# EAGLE design badge-seeed (EAGLE 7.7.0)
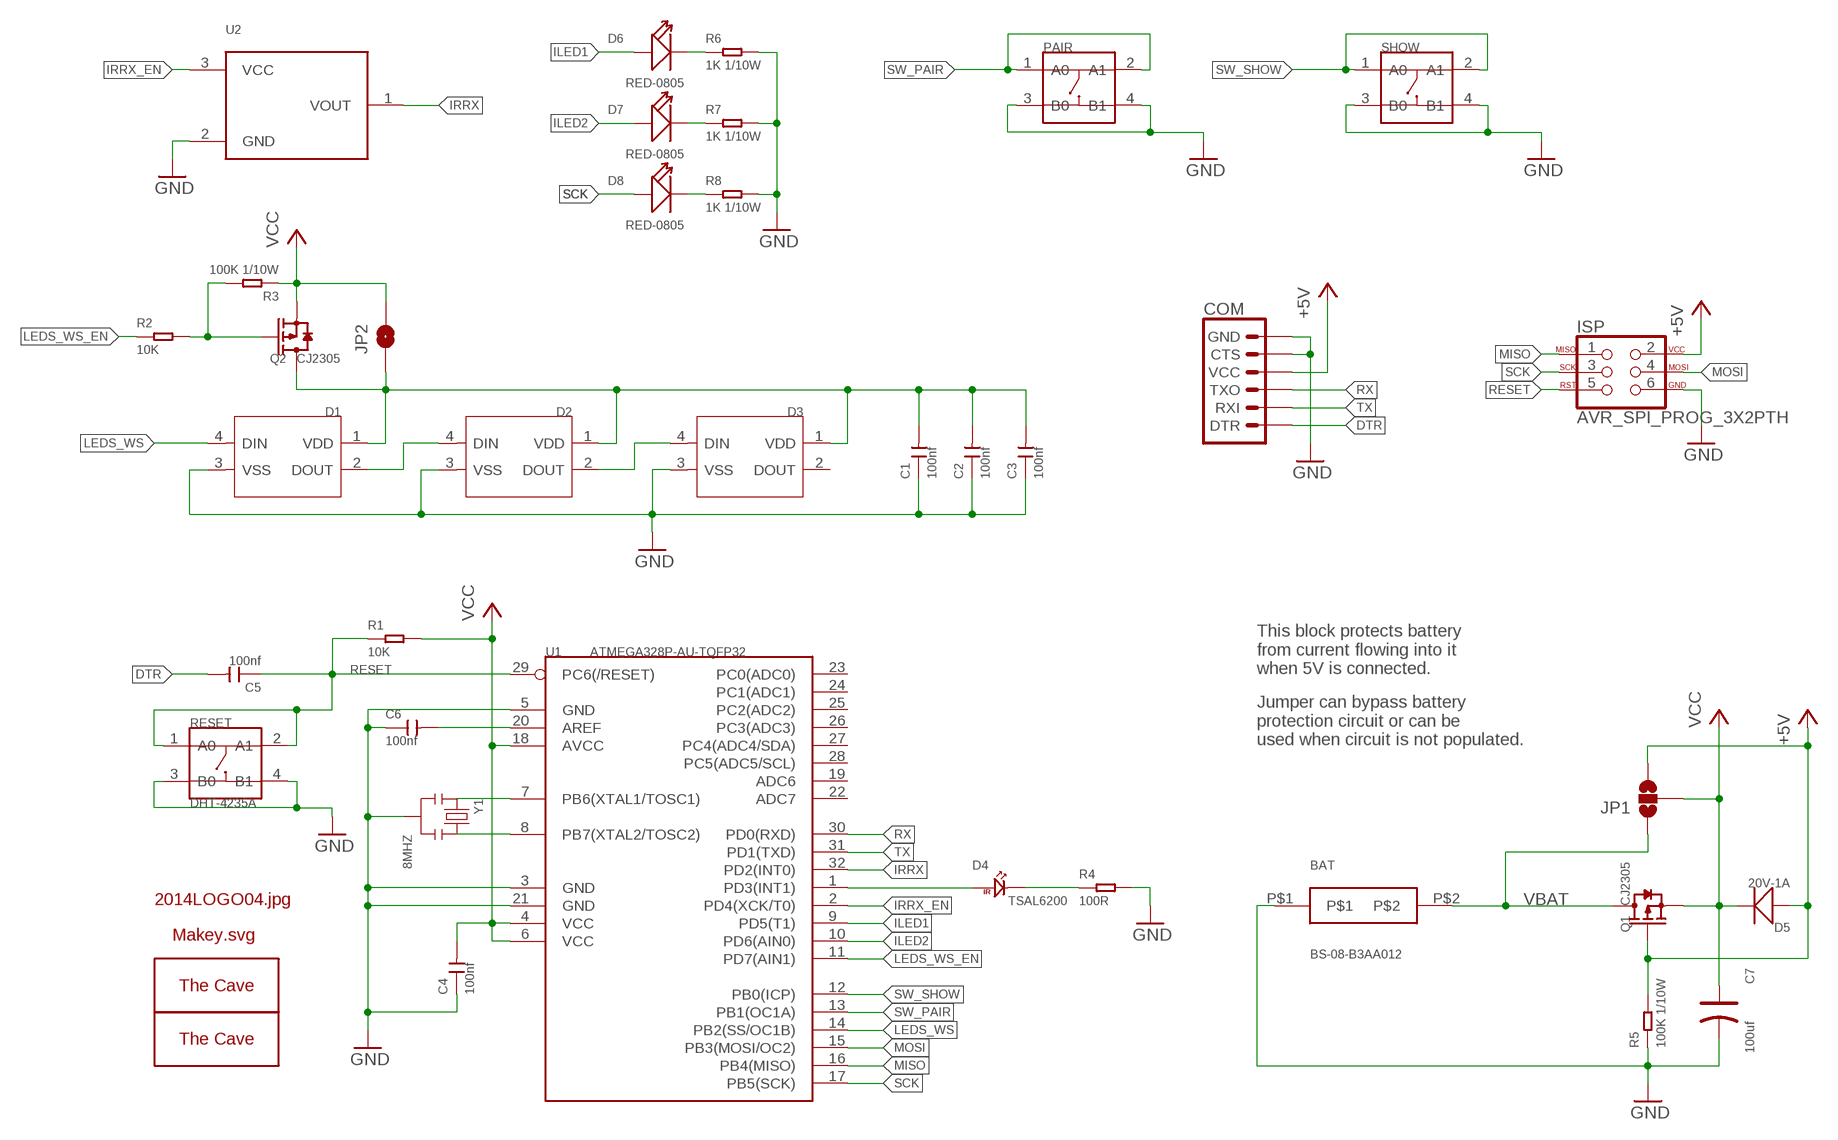
[diagram p0: schematic, sheet 1]

## Parts
BAT  BS-08-B3AA012  [B3-08-B3AA012]
C1  100nf  CERAMIC-100NF-50V-10%-X7R(0603)  [C0603]
C2  100nf  CERAMIC-100NF-50V-10%-X7R(0603)  [C0603]
C3  100nf  CERAMIC-100NF-50V-10%-X7R(0603)  [C0603]
C4  100nf  CERAMIC-100NF-50V-10%-X7R(0603)  [C0603]
C5  100nf  CERAMIC-100NF-50V-10%-X7R(0603)  [C0603]
C6  100nf  CERAMIC-100NF-50V-10%-X7R(0603)  [C0603]
C7  100uf  TANTALUM-SMD-100UF-10V(AVX-B)  [AVX-B]
COM  6_PIN_SERIAL_TARGETSILK  [6_PIN_SERIAL_TARGET_SIDE_W_SILK]
D1  SMD-RGB-LED-4P'WS2812B'  [LED4-SMD-5050]
D2  SMD-RGB-LED-4P'WS2812B'  [LED4-SMD-5050]
D3  SMD-RGB-LED-4P'WS2812B'  [LED4-SMD-5050]
D4  TSAL6200  [TSAL6200]
D5  20V-1A  SMD-DIODE-SCHOTTKY-20V-1A(SOD-123)  [SOD-123]
D6  RED-0805  SMD-LED-CLEAR-RED(0805)  [LED-0805]
D7  RED-0805  SMD-LED-CLEAR-RED(0805)  [LED-0805]
D8  RED-0805  SMD-LED-CLEAR-RED(0805)  [LED-0805]
ISP  AVR_SPI_PROG_3X2PTH  [2X3]
JP1  JUMPER-SMT_3_NO_SILK  [SMT-JUMPER_3_NO_SILK]
JP2  JUMPER-SMT_2_NO_SILK  [SMT-JUMPER_2_NO_SILK]
PAIR  SMD-BUTTON(4P-5.2X5.2X1.5MM-SKQGADE010)-SKQGADE010  [SW4-SMD-5.2X5.2X1.5MM]
Q1  CJ2305  SMD-MOSFET-P-CH-8V-4.1A-CJ2305(SOT-23)  [SOT-23]
Q2  CJ2305  SMD-MOSFET-P-CH-8V-4.1A-CJ2305(SOT-23)  [SOT-23]
R1  10K  SMD-RES-10K-1%-1/10W(0603)  [R0603]
R2  10K  SMD-RES-10K-1%-1/10W(0603)  [R0603]
R3  100K 1/10W  SMD-RES-100K-5%-1/10W(0603)  [R0603]
R4  100R  SMD-RES-100R-5%-1/8W(0805)  [R0805]
R5  100K 1/10W  SMD-RES-100K-5%-1/10W(0603)  [R0603]
R6  1K 1/10W  SMD-RES-1K-5%-1/10W(0603)  [R0603]
R7  1K 1/10W  SMD-RES-1K-5%-1/10W(0603)  [R0603]
R8  1K 1/10W  SMD-RES-1K-5%-1/10W(0603)  [R0603]
RESET  DHT-4235A  SMD-BUTTON-TOP-DHT-4235A(4P-4.2X3.2MM)  [SW4-SMD-4.2X3.2X2.5MM]
SHOW  SMD-BUTTON(4P-5.2X5.2X1.5MM-SKQGADE010)-SKQGADE010  [SW4-SMD-5.2X5.2X1.5MM]
U1  ATMEGA328P-AU-TQFP32  MCU-ATMEGA328P-AU(TQFP32)  [TQFP32-0.8-7X7MM]
U2  TSOP382  [TSOP382]
U$1  2014LOGO04#JPG  [2014LOGO04#JPG]
U$2  MAKEY#SVG  [MAKEY#SVG]
U$3  THECAVE_LOGO_TOP_SMALL  [LOGO_TOP_SMALL]
U$4  THECAVE_LOGO_COPPER_TEXT  [LOGO_COPPER_TEXT]
Y1  8MHZ  SMD-CRYSTAL-8MHZ--0.3%-150R(3P-3.6X1.3MM)  [X3-SMD-3.6X1.3X0.8MM]

## Nets
+5V: COM.P$4(VCC) D5.+ ISP.2 JP1.3 Q1.1(G) R5.2
DTR: C5.2 COM.P$1(DTR)
GND: BAT.P$1 C1.1 C2.1 C3.1 C4.1 C6.1 C7.- COM.P$5(CTS) COM.P$6(GND) D1.3(VSS) D2.3(VSS) D3.3(VSS) ISP.6 PAIR.3(B0) PAIR.4(B1) R4.2 R5.1 R6.2 R7.2 R8.2 RESET.3(B0) RESET.4(B1) SHOW.3(B0) SHOW.4(B1) U1.3(GND) U1.5(GND) U1.21(GND) U2.2(GND) Y1.2
ILED1: D6.+ U1.9(PD5(T1))
ILED2: D7.+ U1.10(PD6(AIN0))
IRRX: U1.32(PD2(INT0)) U2.1(VOUT)
IRRX_EN: U1.2(PD4(XCK/T0)) U2.3(VCC)
LEDS_WS: D1.4(DIN) U1.14(PB2(SS/OC1B))
LEDS_WS_EN: R2.1 U1.11(PD7(AIN1))
MISO: ISP.1 U1.16(PB4(MISO))
MOSI: ISP.4 U1.15(PB3(MOSI/OC2))
N$1: D1.2(DOUT) D2.4(DIN)
N$2: D2.2(DOUT) D3.4(DIN)
N$3: D7.- R7.1
N$4: U1.7(PB6(XTAL1/TOSC1)) Y1.1
N$5: U1.8(PB7(XTAL2/TOSC2)) Y1.3
N$6: D4.N R4.1
N$7: C6.2 U1.20(AREF)
N$8: D6.- R6.1
N$9: D8.- R8.1
N$10: C1.2 C2.2 C3.2 D1.1(VDD) D2.1(VDD) D3.1(VDD) JP2.1 Q2.3(D)
N$11: D4.P U1.1(PD3(INT1))
N$12: Q2.1(G) R2.2 R3.2
RESET: C5.1 ISP.5 R1.1 RESET.1(A0) RESET.2(A1) U1.29(PC6(/RESET))
RX: COM.P$2(TXO) U1.30(PD0(RXD))
SCK: D8.+ ISP.3 U1.17(PB5(SCK))
SW_PAIR: PAIR.1(A0) PAIR.2(A1) U1.13(PB1(OC1A))
SW_SHOW: SHOW.1(A0) SHOW.2(A1) U1.12(PB0(ICP))
TX: COM.P$3(RXI) U1.31(PD1(TXD))
VBAT: BAT.P$2 JP1.1 Q1.3(D)
VCC: C4.2 C7.+ D5.- JP1.2 JP2.2 Q1.2(S) Q2.2(S) R1.2 R3.1 U1.4(VCC) U1.6(VCC) U1.18(AVCC)
Unconnected: D3.2(DOUT) U1.19(ADC6) U1.22(ADC7) U1.23(PC0(ADC0)) U1.24(PC1(ADC1)) U1.25(PC2(ADC2)) U1.26(PC3(ADC3)) U1.27(PC4(ADC4/SDA)) U1.28(PC5(ADC5/SCL))

## Notes on the sheet
- This block protects battery
  from current flowing into it
  when 5V is connected.
- Jumper can bypass battery
  protection circuit or can be
  used when circuit is not populated.

## Library data of the parts
BAT = Seeed-OPL-2017-01-connector-edward:BS-08-B3AA012: 320170000
C1-C6 = Seeed-Capacitor:CERAMIC-100NF-50V-10%-X7R(0603): 302010138; MPN: CC0603KRX7R9BB104
C7 = Seeed-Capacitor:TANTALUM-SMD-100UF-10V(AVX-B): 302020015; MPN: TAJB107M010#NJ
COM = SparkFun-Connectors:6_PIN_SERIAL_TARGET: 6-pin header connection for use with the "FTDI BASIC" pinout - TARGET SIDE. Also known as "Arduino Serial Program Header". It is used to mate with our FTDI Basic serial programmers using the Arduino IDE. Note, this device has "TARGET" in the name. It is intended to be used on a design that contains a target micro-controller that you wish to program. The "sister" device, named "CABLE" is inteneded to be used on a design that usually lives on the end of your USB cable and prvides the converter chip (FTDI232 or FTDI231x) to commnicate serial RX/TX. You can populate with some of these: Break Away Headers - Straight <https://www.sparkfun.com/products/116> (PRT-00116) For reference (or to suit your programming needs) check out these designs: SparkFun FTDI Basic Breakout - 5V <https://www.sparkfun.com/products/9716> (DEV-09716) SparkFun FTDI Basic Breakout - 3.3V <https://www.sparkfun.com/products/9873> (DEV-09873) SparkFun FTDI SmartBasic <https://www.sparkfun.com/products/12935> (DEV-12935) SparkFun Beefy 3 - FTDI Basic Breakout <https://www.sparkfun.com/products/13746> (DEV-13746)
D1-D3 = Seeed-Diode:SMD-RGB-LED-4P: 304990003
D4 = Seeed-OPL-2017-01-Sensor-camilo:TSAL6200: 314020023
D5 = Seeed-OPL-2017-01-Diode-james:SMD-DIODE-SCHOTTKY-20V-1A(SOD-123): 304020034; MPN: B5819W
D6-D8 = Seeed-LED:SMD-LED-CLEAR-RED(0805): 304090046; MPN: 17-215SURC/S530-A2/TR8
ISP = SparkFun-Connectors:AVR_SPI_PROG_3X2: AVR ISP 6 Pin This is the reduced ISP connector for AVR programming. Common on Arduino. This footprint will take up less PCB space and can be used with a 10-pin to 6-pin adapter such as SKU: BOB-08508 **Special note about "TEST_POINT" package. The stop mask is on the top side, so if you want your programming test points to be on the bottom of your board, make sure to place this package on the bottom side of the board. This also ensure that the orientation to program from the bottom side will be correct. SparkFun Products: SparkFun ISP Pogo Adapter <https://www.sparkfun.com/products/11591> - NS Tiny AVR Programmer <https://www.sparkfun.com/products/11801> -PTH
JP1 = SparkFun-Jumpers:JUMPER-SMT_3_NO: Normally open jumper This jumper has three pads in close proximity to each other. Apply solder to close the connection(s).
JP2 = SparkFun-Jumpers:JUMPER-SMT_2_NO: Normally open jumper This jumper has two pads in close proximity to each other. Apply solder to close the connection. Round pads are easier to solder for beginners, but are a lot larger. SparkFun Product that uses the round pads: SparkFun EL Sequencer <https://www.sparkfun.com/products/12781>
PAIR SHOW = Seeed-Switch:SMD-BUTTON(4P-5.2X5.2X1.5MM-SKQGADE010): 311020017; MPN: SKQGADE010; VALUE: SKQGADE010
Q1 Q2 = Seeed-Transistor:SMD-MOSFET-P-CH-8V-4.1A-CJ2305(SOT-23): 305030014; MPN: CJ2305
R1 R2 = Seeed-Resistor:SMD-RES-10K-1%-1/10W(0603): 301010299; MPN: RC0603FR-0710KL
R3 R5 = Seeed-Resistor:SMD-RES-100K-5%-1/10W(0603): 301010089; MPN: RC0603JR-07100KL
R4 = Seeed-Resistor:SMD-RES-100R-5%-1/8W(0805): 301010319; MPN: RC0805JR-07100RL
R6-R8 = Seeed-Resistor:SMD-RES-1K-5%-1/10W(0603): 301010291; MPN: RC0603JR-071KL
RESET = Seeed-Switch:SMD-BUTTON-TOP-DHT-4235A(4P-4.2X3.2MM): 311020045; MPN: DHT-4235A
U1 = Seeed-IC:MCU-ATMEGA328P-AU(TQFP32): 310010049; MPN: ATMEGA328P-AU
U2 = Seeed-OPL-2017-01-Sensor-camilo:TSOP382: 314020013
U$1 = 2014LOGO04#jpg:2014LOGO04#JPG
U$2 = Makey#svg:MAKEY#SVG
U$3 U$4 = thecave:THECAVE_LOGO: The Cave DIY workshop logos thecave.cz
Y1 = Seeed-Crystal Oscillator:SMD-CRYSTAL-8MHZ--0.3%-150R(3P-3.6X1.3MM): 306010053

## Board
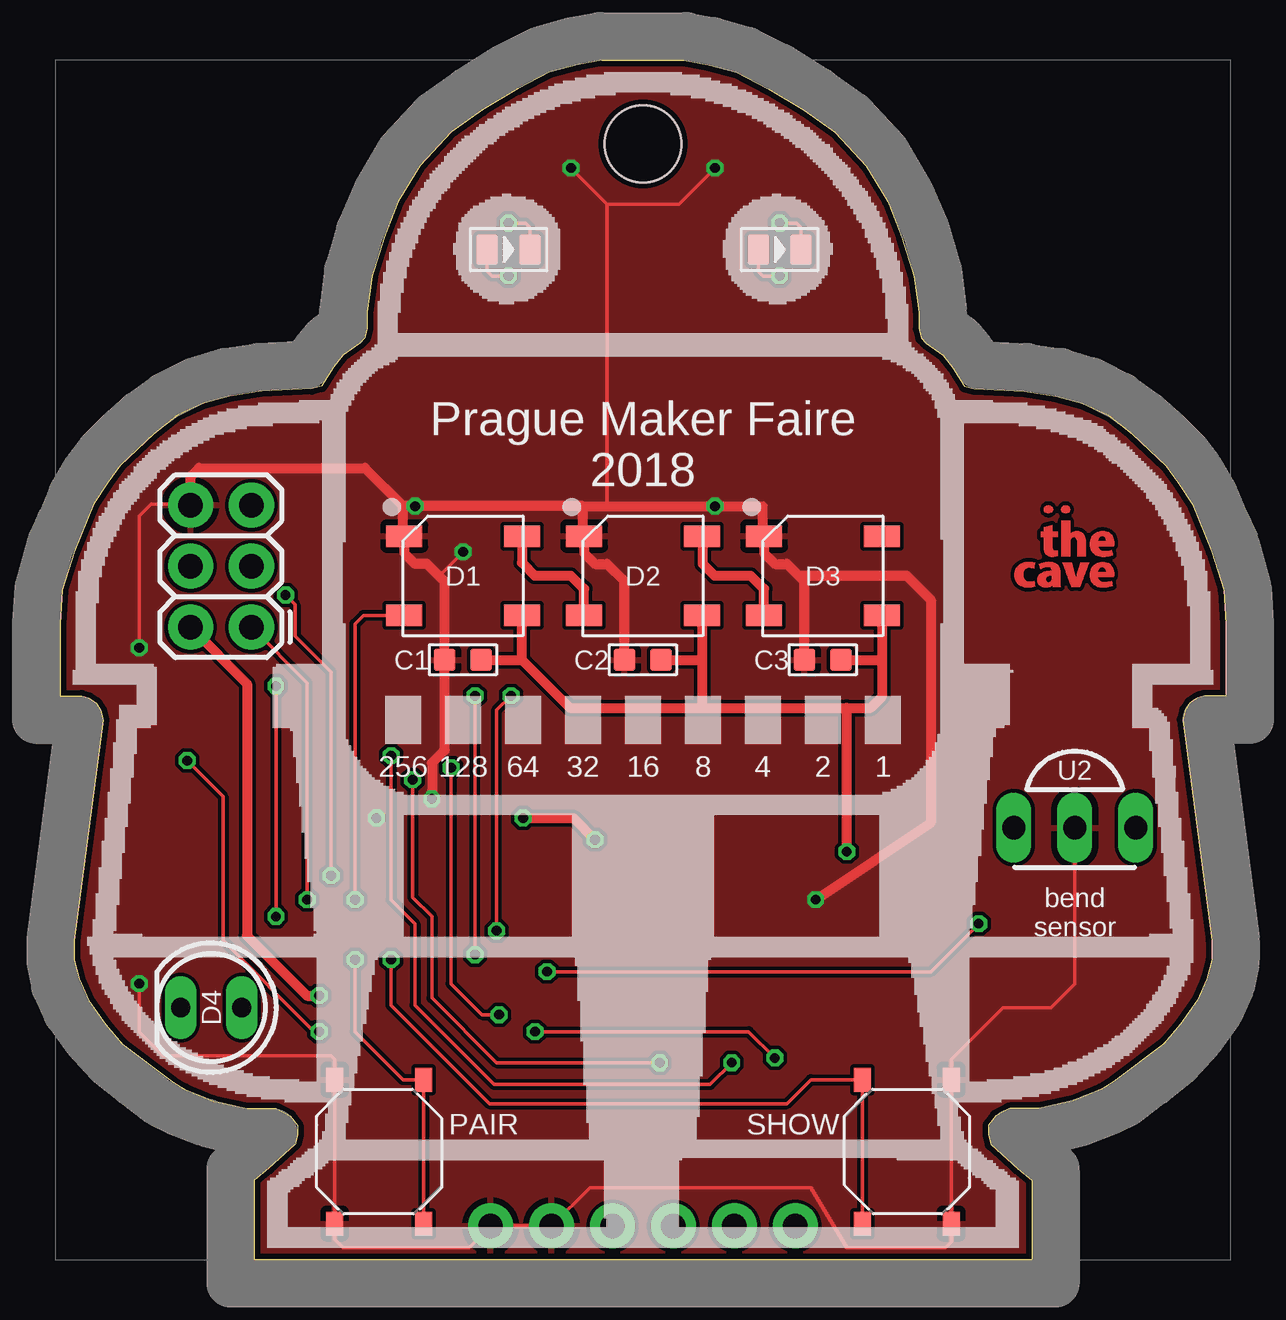
[diagram p1: board, top side]
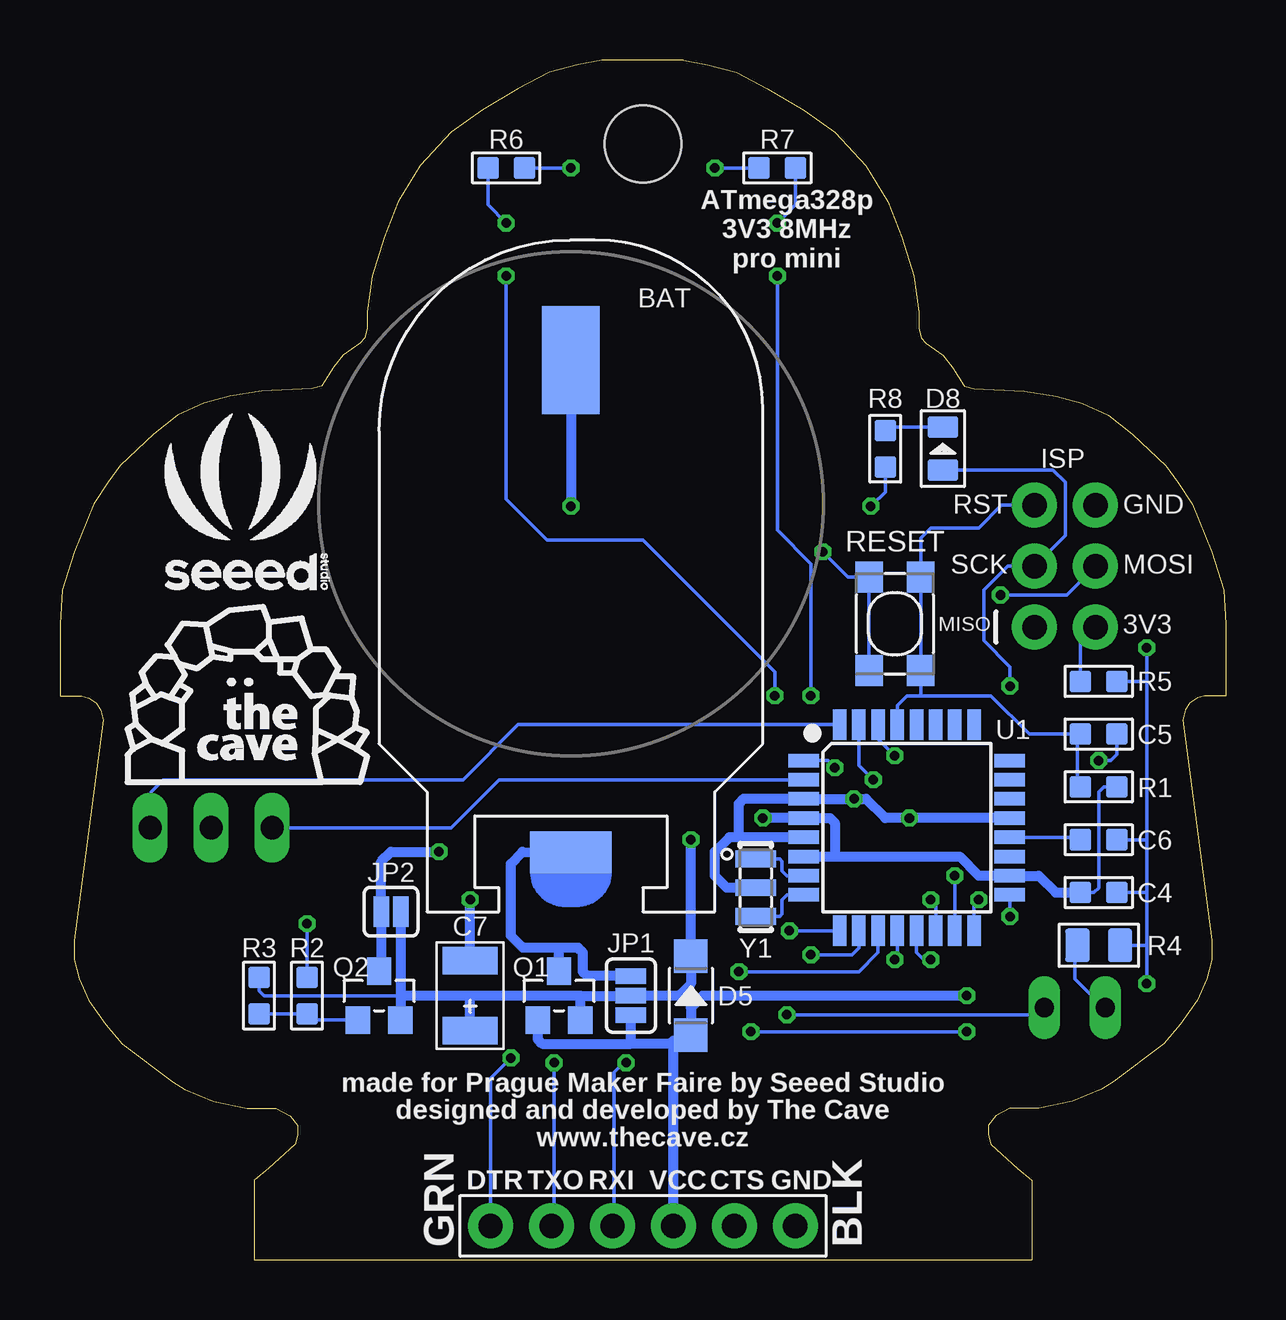
[diagram p2: board, bottom side, seen from below]

Size 48.6 x 50 mm. Coordinates in mm from the lower left corner, seen from the top.
Outline: 22.6,50 21.6,49.8 20.4,49.5 19.1,48.8 17.6,47.9 16.3,47 15,45.6 14.1,44.1 13.5,42.6 13,41 12.8,39.5 12.8,38.8 12.7,38.4 12.5,38.2 11.8,37.7 11.4,37.2 10.9,36.4 10.5,36.3 8.4,36.2 7.1,36 6,35.7 4.9,35.2 3.9,34.4 2.5,33.1 2,32.4 1.4,31.5 0.6,29.5 0.1,27.9 0,26.5 0,23.5 0.9,23.5 1.2,23.4 1.5,23.2 1.7,22.9 1.8,22.5 0.6,13.3 0.6,12.5 0.8,11.7 1.2,10.8 1.9,9.8 2.6,9 4.7,7.4 5.2,7.1 6.4,6.6 7.8,6.3 9,6.3 9.6,6 9.9,5.6 9.9,5.2 9.8,4.8 8.7,3.8 8.1,3.3 8.1,0 40.5,0 40.5,3.3 39.9,3.8 38.8,4.8 38.7,5.2 38.7,5.6 39,6 39.6,6.3 40.8,6.3 42.2,6.6 43.4,7.1 43.9,7.4 46,9 46.7,9.8 47.4,10.8 47.8,11.7 48,12.5 48,13.3 46.8,22.5 46.9,22.9 47.1,23.2 47.4,23.4 47.7,23.5 48.6,23.5 48.6,26.5 48.5,27.9 48,29.5 47.2,31.5 46.6,32.4 46.1,33.1 44.7,34.4 43.7,35.2 42.6,35.7 41.5,36 40.2,36.2 38.1,36.3 37.7,36.4 37.2,37.2 36.8,37.7 36.1,38.2 35.9,38.4 35.8,38.8 35.8,39.5 35.6,41 35.1,42.6 34.5,44.1 33.6,45.6 32.3,47 31,47.9 29.5,48.8 28.2,49.5 27,49.8 26,50 22.6,50
Copper layers (1*16): Top 0.035mm / dielectric 1.5mm / Bottom 0.035mm
Design rules "SeeedStudio_2layer_DRU_no_angle_20140221": minimum track width 6mil, minimum drill 12mil, track to track 6mil, track to pad 6mil, pad to pad 6mil, via to via 6mil, smd to smd 0mil, copper to edge 10mil, drill to drill 10mil, minimum pad ring 10mil, minimum via ring 6mil, stop-mask expansion 2mil, vias tented up to drill 100mil, thermal gap 10mil
Holes 3.2 mm at 24.3,46.5

### Footprints (pad centres in the part's own frame; a part is rotated, then mirrored left to right if it is on the bottom)
B3-08-B3AA012 = smd 4.5 x 2.4: P$1 0,0 | smd 1.75 x 3.4: P$2 20.525,0
C0603 = smd 0.889 x 0.889: 1 0,0.762; 2 0,-0.762
AVX-B = smd 1.143 x 2.286: + -1.46,0; - 1.46,0
6_PIN_SERIAL_TARGET_SIDE_W_SILK = drill 1.016 pad 1.88: P$1 -6.35,0; P$2 -3.81,0; P$3 -1.27,0; P$4 1.27,0; P$5 3.81,0; P$6 6.35,0
LED4-SMD-5050 = smd 1.5 x 0.9: 1 -2.45,1.65; 2 -2.45,-1.65; 3 2.45,-1.65; 4 2.45,1.65
TSAL6200 = drill 0.8 long: N 1.27,0; P -1.27,0
SOD-123 = smd 1.397 x 1.397: + -1.651,0; - 1.651,0
LED-0805 = smd 0.889 x 1.27: + -0.889,0; - 0.889,0
2X3 = drill 1.016 pad 1.88: 1 0,0; 2 0,2.54; 3 2.54,0; 4 2.54,2.54; 5 5.08,0; 6 5.08,2.54
SMT-JUMPER_3_NO_SILK = smd 0.635 x 1.27: 1 -0.813,0; 2 0,0; 3 0.813,0
SMT-JUMPER_2_NO_SILK = smd 0.635 x 1.27: 1 -0.406,0; 2 0.406,0
SW4-SMD-5.2X5.2X1.5MM = smd 1 x 0.7: 1 -3,1.85; 2 3,1.85; 3 -3,-1.85; 4 3,-1.85
SOT-23 = smd 1.016 x 1.143: 1 -0.889,-1.016; 2 0.889,-1.016; 3 0,1.016
R0603 = smd 0.889 x 0.889: 1 0,0.762; 2 0,-0.762
R0805 = smd 1.397 x 1.016: 1 0,0.889; 2 0,-0.889
SW4-SMD-4.2X3.2X2.5MM = smd 1.3 x 1.15: 1 -1.95,1.075; 2 1.95,1.075; 3 -1.95,-1.075; 4 1.95,-1.075
TQFP32-0.8-7X7MM = smd 1.27 x 0.559: 1 -4.293,2.8; 2 -4.293,2; 3 -4.293,1.2; 4 -4.293,0.4; 5 -4.293,-0.4; 6 -4.293,-1.2; 7 -4.293,-2; 8 -4.293,-2.8; 17 4.293,-2.8; 18 4.293,-2; 19 4.293,-1.2; 20 4.293,-0.4; 21 4.293,0.4; 22 4.293,1.2; 23 4.293,2; 24 4.293,2.8 | smd 0.559 x 1.27: 9 -2.8,-4.293; 10 -2,-4.293; 11 -1.2,-4.293; 12 -0.4,-4.293; 13 0.4,-4.293; 14 1.2,-4.293; 15 2,-4.293; 16 2.8,-4.293; 25 2.8,4.293; 26 2,4.293; 27 1.2,4.293; 28 0.4,4.293; 29 -0.4,4.293; 30 -1.2,4.293; 31 -2,4.293; 32 -2.8,4.293
TSOP382 = drill 0.96 long: 1 2.54,0; 2 0,0; 3 -2.54,0
X3-SMD-3.6X1.3X0.8MM = smd 0.7 x 1.7: 1 -1.2,0; 2 0,0; 3 1.2,0

### Placement (x,y rotation side)
BAT  27.3,37.5 270 bottom
C1  16.8,25 90 top
C2  24.3,25 90 top
C3  31.8,25 90 top
C4  5.3,15.3 270 bottom
C5  5.3,21.9 90 bottom
C6  5.3,17.5 270 bottom
C7  31.5,11 90 bottom
COM  24.3,1.4 0 bottom
D1  16.8,28.5 180 top
D2  24.3,28.5 180 top
D3  31.8,28.5 180 top
D4  6.3,10.5 180 top
D5  22.3,11 90 bottom
D6  30,42.1 0 top
D7  18.7,42.1 0 top
D8  11.8,33.8 90 bottom
ISP  7.98,26.36 90 top
JP1  24.8,11 270 bottom
JP2  34.8,14.5 0 bottom
PAIR  13.3,4.5 270 top
Q1  27.8,11 0 bottom
Q2  35.3,11 0 bottom
R1  5.3,19.7 90 bottom
R2  38.3,11 0 bottom
R3  40.3,11 0 bottom
R4  5.3,13.1 90 bottom
R5  5.3,24.1 270 bottom
R6  30,45.5 90 bottom
R7  18.7,45.5 270 bottom
R8  14.2,33.8 0 bottom
RESET  13.8,26.5 270 bottom
SHOW  35.3,4.5 90 top
U1  13.3,18 0 bottom
U2  42.3,18 0 top
U$1  40.8,31.5 0 bottom
U$2  24.3,25 0 top
U$3  45.8,19.9 0 bottom
U$4  39.8,28 0 top
Y1  19.6,15.5 270 bottom

### Tracks (layer width: path | path; a pad name or v marks a point on that pad's centre or on a via)
+5V  (via drill 0.4)
  Top 0.406: ISP.2 7.8,24 7.8,13.5 10.3,11 v10.8,11
  Bottom 0.152: R5.2 6.06,25.74 ISP.2
  Bottom 0.406: Q1.1 28.69,9.19 28.5,9 24.8,9 | 24.8,9 JP1.3 | D5.+ 23.15,9 24.8,9 | COM.P$4 23.03,9.12 D5.+ | v10.8,11 21.8,11 22.3,10.5 D5.+ | 22.45,9 D5.+ | 22.65,9.5 D5.+
DTR  (via drill 0.4)
  Top 0.152: v29.8,8.4 28.7,9.5 v19.8,9.5 | v10.8,9.5 10.6,9.5 6.8,13.3 6.8,19.3 v5.3,20.8
  Bottom 0.152: v10.8,9.5 v19.8,9.5 | v5.3,20.8 4.8,20.8 4.54,21.06 C5.2 | COM.P$1 30.65,7.55 v29.8,8.4
GND  (via drill 0.4)
  Top 0.152: v27.3,45.5 25.8,44 22.8,44 | v21.3,45.5 22.8,44 | v3.3,25.5 3.3,31 3.8,31.5 5.38,31.5 ISP.6 | v3.3,11.5 3.3,9.5 4.3,8.5 11.3,8.5 11.45,8.35 PAIR.3 PAIR.4 11.45,0.85 11.8,0.5 17.05,0.5 COM.P$6 COM.P$5 22.09,3 31.3,3 32.8,0.5 36.9,0.5 37.15,0.75 SHOW.3 SHOW.4 37.15,8.35 39.3,10.5 41.3,10.5 42.3,11.5 U2.2 | 22.8,44 22.8,31.4 | v16.8,29.5 15.8,28.5
  Top 0.406: D2.3 21.8,30.2 | D2.3 21.85,29.45 22.3,29 22.8,29 23.53,28.27 23.53,25.01 C2.1 | 30.8,28.5 30.3,29 29.8,29 29.35,29.45 D3.3 29.3,30.15 29.3,31.4 v27.3,31.4 22.8,31.4 21.8,31.4 | 14.3,31.4 14.3,30.2 D1.3 14.35,29.45 14.8,29 15.3,29 15.8,28.5 16.03,28.27 16.03,25.01 | D2.3 21.8,30.15 21.8,31.4 | 21.8,31.4 v14.8,31.4 14.3,31.4 | 14.3,31.4 12.7,33 5.8,33 5.44,32.64 ISP.6 | v15.5,19.2 15.5,20.7 16.04,21.24 C1.1 | 30.8,28.5 35.3,28.5 36.3,27.5 36.3,18.2 v31.5,15 | v13.19,18.4 v13.2,18.4 | C3.1 31.04,28.26 30.8,28.5
  Bottom 0.152: R4.2 3.3,13.1 | v3.3,25.5 3.3,24.1 | 3.3,24.1 3.3,17.5 | 3.3,17.5 3.3,15.3 | 3.3,15.3 3.3,13.1 | 3.3,13.1 v3.3,11.5 | RESET.4 RESET.3 15.75,28.45 v16.8,29.5 | R5.1 3.3,24.1 | 14.5,31.7 v14.8,31.4 14.2,32 R8.2 | C6.1 3.3,17.5 | C4.1 3.3,15.3 | R6.2 v27.3,45.5 | R7.2 v21.3,45.5
  Bottom 0.406: U1.21 v13.19,18.4 14.2,18.4 15,19.2 v15.5,19.2 U1.3 20.1,19.2 20.3,19 20.3,17.6 | U1.5 20.3,17.6 | 20.3,17.6 20.7,17.6 21.3,17 21.3,16 20.8,15.5 Y1.2 | BAT.P$1 v27.3,31.4 | C7.- v31.5,15
  pour Top: -1.7,-1.5 -1.7,50 50.3,50.5 50.3,-1
ILED1  (via drill 0.4)
  Top 0.152: v18.2,13.7 18.2,22.9 v18.8,23.5 | v30,41 29.3,41 29.1,41.2 29.11,41.21 D6.+
  Bottom 0.152: U1.9 16.99,13.71 17.7,13.7 v18.2,13.7 | v18.8,23.5 18.8,24.5 24.3,30 28.3,30 30,31.7 v30,41
ILED2  (via drill 0.4)
  Top 0.152: v17.3,12.7 17.3,13.2 v17.3,23.5 | v18.7,41 18,41 17.8,41.2 17.81,41.21 D7.+
  Bottom 0.152: U1.10 15.3,13 15.6,12.7 v17.3,12.7 | v17.3,23.5 17.3,29 18.7,30.4 v18.7,41
IRRX
  Bottom 0.152: U1.32 29.51,22.29 31.8,20 44.3,20 44.8,19.5 44.8,19.04 U2.1
IRRX_EN
  Bottom 0.152: U1.2 30.3,20 32.3,18 U2.3
LEDS_WS  (via drill 0.4)
  Top 0.152: v12.3,15 12.3,26.5 12.65,26.85 D1.4
  Bottom 0.152: U1.14 12.1,14.8 v12.3,15
LEDS_WS_EN  (via drill 0.4)
  Top 0.152: v20.3,12 36.3,12 v38.3,14
  Bottom 0.152: U1.11 14.5,12.8 15.3,12 v20.3,12 | R2.1 v38.3,14
MISO  (via drill 0.4)
  Top 0.152: v10.3,15 10.3,24.04 ISP.1
  Bottom 0.152: U1.16 10.5,14.8 v10.3,15
MOSI  (via drill 0.4)
  Top 0.152: v11.3,16 11.3,24.5 9.8,26 9.8,27.3 v9.4,27.7
  Bottom 0.152: U1.15 v11.3,16 | ISP.4 6.64,27.7 v9.4,27.7
N$1
  Top 0.406: D1.2 19.25,29.05 19.8,28.5 21.3,28.5 21.85,27.95 D2.4
N$2
  Top 0.406: D3.4 29.35,27.95 28.8,28.5 27.3,28.5 26.8,29 26.8,30.1 D2.2
N$3  (via drill 0.4)
  Top 0.152: D7.- 19.59,43.01 19.4,43.2 v18.7,43.2
  Bottom 0.152: 18.41,43.49 v18.7,43.2 17.94,43.96 R7.1
N$4
  Bottom 0.152: U1.7 18.3,16 18.5,16.2 18.5,16.6 18.6,16.7 Y1.1
N$5
  Bottom 0.152: Y1.3 18.6,14.3 18.5,14.4 18.5,15 18.3,15.2 U1.8
N$6
  Bottom 0.152: R4.1 6.3,12.49 6.3,11.7 5.1,10.5 D4.N
N$7
  Bottom 0.152: U1.20 6.06,17.6 C6.2
N$8  (via drill 0.4)
  Top 0.152: D6.- 30.89,43.01 30.7,43.2 v30,43.2
  Bottom 0.152: 30.19,43.39 v30,43.2 30.76,43.96 R6.1
N$9
  Bottom 0.152: D8.- 14.2,34.69 R8.1
N$10  (via drill 0.4)
  Top 0.406: D2.1 26.75,25 | 26.75,25 26.75,23.05 26.8,23 | D3.1 34.25,25 | 34.25,25 34.25,23.45 33.8,23 32.8,23 | 26.8,23 21.25,23 19.25,25 | 26.8,23 32.8,23 | v32.8,17 32.8,23 | 19.25,25 D1.1 | C2.2 26.75,25 | C1.2 19.25,25 | C3.2 34.25,25
  Bottom 0.406: v32.8,17 34.8,17 35.21,16.59 JP2.1 35.21,12.11 Q2.3
N$11  (via drill 0.4)
  Top 0.152: v16.3,20.5 16.3,11.5 17.6,10.2 v18.3,10.2
  Bottom 0.152: U1.1 16.6,20.8 v16.3,20.5 | D4.P 7.8,10.2 v18.3,10.2
N$12
  Bottom 0.152: Q2.1 38.05,9.98 R2.2 R3.2
RESET
  Bottom 0.152: ISP.5 9.36,31.44 10.3,30.5 12.3,30.5 12.73,30.07 RESET.1 RESET.2 12.73,23.57 12.8,23.5 | U1.29 13.7,23.1 13.3,23.5 12.8,23.5 | 12.8,23.5 9.8,23.5 8.2,21.9 C5.1 6.19,21.77 6.19,19.83 R1.1
RX  (via drill 0.4)
  Top 0.152: v13.8,21 13.8,15 14.8,14 14.8,10.6 18.1,7.3 27.1,7.3 v28,8.2
  Bottom 0.152: U1.30 14.5,21.7 v13.8,21 | v28,8.2 28,1.51 COM.P$2
SCK  (via drill 0.4)
  Top 0.152: v9,14.3 v9,23.9
  Bottom 0.152: U1.17 9.01,14.51 v9,14.3 | v9,23.9 9,24.7 10.1,25.8 10.1,27.9 9.1,28.9 ISP.3 6.7,30.18 6.7,32.4 7.21,32.91 D8.+
SW_PAIR  (via drill 0.4)
  Top 0.152: v12.3,12.5 12.3,9.5 14.3,7.5 PAIR.1 PAIR.2
  Bottom 0.152: U1.13 12.9,12.8 12.6,12.5 v12.3,12.5
SW_SHOW  (via drill 0.4)
  Top 0.152: v13.8,12.5 13.8,10.6 17.9,6.5 30.3,6.5 31.3,7.5 SHOW.2 SHOW.1
  Bottom 0.152: U1.12 13.7,12.6 v13.8,12.5
TX  (via drill 0.4)
  Top 0.152: v14.7,20 14.7,15.1 15.5,14.3 15.5,10.9 18.2,8.2 v25,8.2
  Bottom 0.152: U1.31 15.3,20.6 v14.7,20 | v25,8.2 25.1,8.2 25.5,7.8 25.5,1.47 COM.P$3
VBAT
  Bottom 0.406: Q1.3 27.8,13 | JP1.1 26.61,11.81 26.8,12 26.8,12.8 27,13 27.8,13 | 27.8,13 29.3,13 29.8,13.5 29.8,16.5 29.32,17 BAT.P$2
VCC  (via drill 0.4)
  Top 0.406: v19.3,18.4 21.4,18.4 v22.3,17.5
  Bottom 0.152: R1.2 5.1,19.7 5.3,19.5 5.3,15.5 5.5,15.3 C4.2 | 34.39,11 40.1,11 40.3,11.2 R3.1
  Bottom 0.406: U1.6 16.3,16.8 | 16.3,16.8 16.3,18.2 16.5,18.4 U1.4 v19.3,18.4 | 16.3,16.8 11.1,16.8 10.3,16 U1.18 7.8,16 7.1,15.3 C4.2 | v22.3,17.5 D5.- 22.3,11.5 22.8,11 JP1.2 26.91,11 | Q1.2 26.91,11 | 26.91,11 31.5,11 | 31.5,11 34.39,11 | JP2.2 34.39,11 | 34.39,11 34.39,10 Q2.2 | C7.+ 31.5,11

### Text on the board
tPlace: 256 | 128 | 64 | 32 | 16 | 8 | 4 | 2 | 1
tNames: Prague Maker Faire / 2018 | bend / sensor
bNames: ATmega328p / 3V3 8MHz / pro mini | GND | RST | MOSI | SCK | 3V3 | MISO | made for Prague Maker Faire by Seeed Studio / designed and developed by The Cave / www.thecave.cz